# EAGLE design Stash_cap_board_hardctrl rev_H (EAGLE 9.6.2)
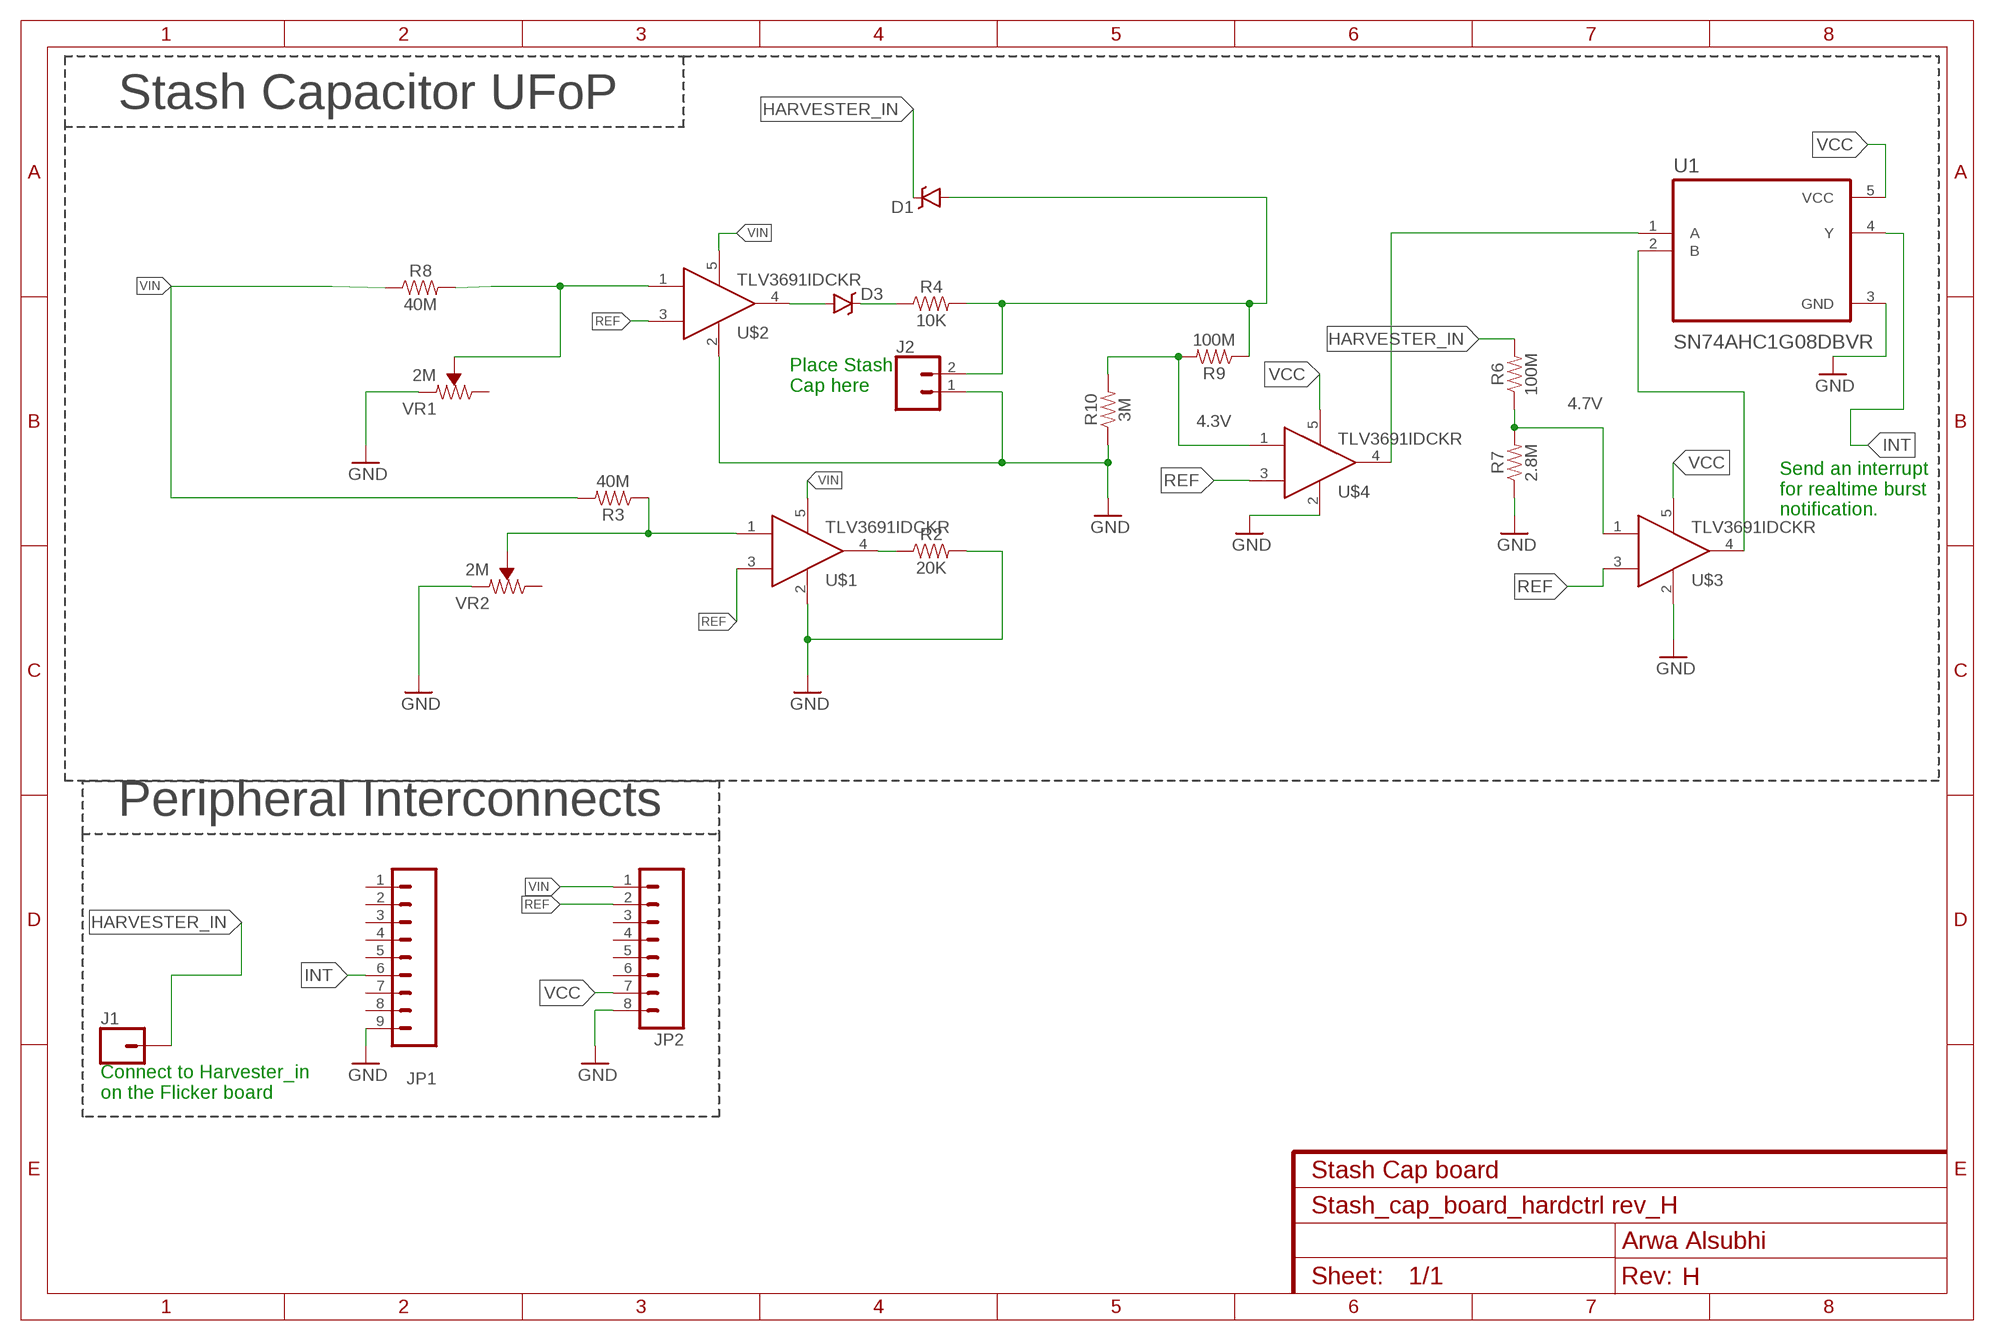
[diagram p0: schematic, sheet 1]
FRAME2 (FRAME-A4L): CNAME: Stash Cap board; CREVISION: H; DESIGNER: Arwa Alsubhi

## Parts
D1  RB751  DIODE-SCHOTTKY-RB751  [SOD-523]
D3  RB751  DIODE-SCHOTTKY-RB751  [SOD-523]
J1  CONN_01  [1X01]
J2  CONN_02  [1X02]
JP1  M091.27MM  [1X09-1.27MM]
JP2  M081.27MM  [1X08-1.27MM]
R2  20K  0.3OHM-0805-1/8W-1%  [0805]
R3  40M  0.3OHM-0805-1/8W-1%  [0805]
R4  10K  0603-RESISTOR-0603-1/10W-1%  [0603]
R6  100M  0.3OHM-0805-1/8W-1%  [0805]
R7  2.8M  0.3OHM-0805-1/8W-1%  [0805]
R8  40M  0.3OHM-0805-1/8W-1%  [0805]
R9  100M  0.3OHM-0805-1/8W-1%  [0805]
R10  3M  0.3OHM-0805-1/8W-1%  [0805]
U1  SN74AHC1G08DBVR  [SOT95P280X145-5N]
U$1  TLV3691IDCKR  [SOT353]
U$2  TLV3691IDCKR  [SOT353]
U$3  TLV3691IDCKR  [SOT353]
U$4  TLV3691IDCKR  [SOT353]
VR1  2M  TRIMPOT-SMD-3MM-CLOSED-1/8W-20%  [TRIMPOT-SMD-3MM-CLOSED]
VR2  2M  TRIMPOT-SMD-3MM-CLOSED-1/8W-20%  [TRIMPOT-SMD-3MM-CLOSED]

## Nets
CAP_VCC: D1.A J2.2 R4.2 R9.1
GND: J2.1 JP1.9 JP2.8 R2.2 R7.1 R10.1 U1.3(GND) U$1.2 U$2.2 U$3.2 U$4.2 VR1.1(CCW) VR2.1(CCW)
HARVESTER_IN: D1.C J1.1 R6.2
INT: JP1.6 U1.4(Y)
N$1: D3.A U$2.4
N$2: R2.1 U$1.4
N$4: R8.2 U$2.1 VR1.2(WIPER)
N$5: R3.1 U$1.1 VR2.2(WIPER)
N$6: R6.1 R7.2 U$3.1
N$7: D3.C R4.1
N$8: R9.2 R10.2 U$4.1
N$9: U1.2(B) U$3.4
N$10: U1.1(A) U$4.4
REF: JP2.2 U$1.3 U$2.3 U$3.3 U$4.3
VCC: JP2.7 U1.5(VCC) U$3.5 U$4.5
VIN: JP2.1 R3.2 R8.1 U$1.5 U$2.5
Unconnected: JP1.1 JP1.2 JP1.3 JP1.4 JP1.5 JP1.7 JP1.8 JP2.3 JP2.4 JP2.5 JP2.6 VR1.3(CW) VR2.3(CW)

## Notes on the sheet
- Stash Capacitor UFoP
- Place Stash 
  Cap here
- 4.7V
- 4.3V
- Send an interrupt 
  for realtime burst 
  notification.
- Peripheral Interconnects
- Connect to Harvester_in 
  on the Flicker board

## Library data of the parts
D1 D3 = SparkFun-DiscreteSemi:DIODE-SCHOTTKY: Schottky diodes in SFE's production catalog BAT20J 1A 23V 0.62Vf RB751 120mA 40V 0.37Vf PMEG4005EJ 0.5A 40V 0.42Vf MBRA140 1A 40V 0.5Vf B340A 3A 40V SMA; DIGIKEY: BAS40-02V-V-G-08GICT-ND; MPN: BAS40-02V-V-G-08; PROD_ID: DIO-11018
J1 = SparkFun-Connectors:CONN_01: Single connection point. Often used as Generic Header-pin footprint for 0.1 inch spaced/style header connections On any of the 0.1 inch spaced packages, you can populate with these: Break Away Headers - Straight <https://www.sparkfun.com/products/116> (PRT-00116) Break Away Male Headers - Right Angle <https://www.sparkfun.com/products/553> (PRT-00553) Female Headers <https://www.sparkfun.com/products/115> (PRT-00115) Break Away Headers - Machine Pin <https://www.sparkfun.com/products/117> (PRT-00117) Break Away Female Headers - Swiss Machine Pin <https://www.sparkfun.com/products/743> (PRT-00743) This device is also useful as a general connection point to wire up your design to another part of your project. Our various solder wires solder well into these plated through hole pads. Hook-Up Wire - Assortment (Stranded, 22 AWG) <https://www.sparkfun.com/products/11375> (PRT-11375) Hook-Up Wire - Assortment (Solid Core, 22 AWG) <https://www.sparkfun.com/products/11367> (PRT-11367) View the entire wire category on our website here <https://www.sparkfun.com/categories/141> Special notes: SMTSO-256-ET is a "flush mount" nut for a 4-40 screw. We mostly use this on specialty testbeds; it is a nice way to connect hardware to your PCB at an adjustable hieght. Also note, the SNAP packages are for using a snappable style connector. We sell a baggie of snaps and they are also used on two LilyPad designs: Snap Assortment - 30 pack (male and female) <https://www.sparkfun.com/products/11347> (DEV-11347) LilyPad Arduino SimpleSnap <https://www.sparkfun.com/products/10941> (DEV-10941) LilyPad SimpleSnap Protoboard <https://www.sparkfun.com/products/10940> (DEV-10940)
J2 = SparkFun-Connectors:CONN_02: Multi connection point. Often used as Generic Header-pin footprint for 0.1 inch spaced/style header connections On any of the 0.1 inch spaced packages, you can populate with these: Break Away Headers - Straight <https://www.sparkfun.com/products/116> (PRT-00116) Break Away Male Headers - Right Angle <https://www.sparkfun.com/products/553> (PRT-00553) Female Headers <https://www.sparkfun.com/products/115> (PRT-00115) Break Away Headers - Machine Pin <https://www.sparkfun.com/products/117> (PRT-00117) Break Away Female Headers - Swiss Machine Pin <https://www.sparkfun.com/products/743> (PRT-00743) For SCREWTERMINALS and SPRING TERMINALS visit here: Screw Terimnals on SparkFun.com <https://www.sparkfun.com/search/results?term=Screw+Terminals> (5mm/3.5mm/2.54mm spacing) This device is also useful as a general connection point to wire up your design to another part of your project. Our various solder wires solder well into these plated through hole pads. Hook-Up Wire - Assortment (Stranded, 22 AWG) <https://www.sparkfun.com/products/11375> (PRT-11375) Hook-Up Wire - Assortment (Solid Core, 22 AWG) <https://www.sparkfun.com/products/11367> (PRT-11367) View the entire wire category on our website here <https://www.sparkfun.com/categories/141> Special notes: Molex polarized connector foot print use with: PRT-08233 with associated crimp pins and housings. 2.54_SCREWTERM for use with PRT-10571. 3.5mm Screw Terminal footprints for PRT-08084 5mm Screw Terminal footprints for use with PRT-08432
JP1 = SparkFun-Connectors:M09: Header 9 Standard 9-pin 0.1" header. Use with straight break away headers (SKU : PRT-00116), right angle break away headers (PRT-00553), swiss pins (PRT-00743), machine pins (PRT-00117), and female headers (PRT-00115).; DIGIKEY: S9014E-09-ND; MANUFACTURERPARTNUMBER: GRPB091VWVN-RC; MPN: GRPB091VWVN-RC
JP2 = SparkFun-Connectors:M08: Header 8 Standard 8-pin 0.1" header. Use with straight break away headers (SKU : PRT-00116), right angle break away headers (PRT-00553), swiss pins (PRT-00743), machine pins (PRT-00117), and female headers (PRT-00115).; DIGIKEY: S9014E-08-ND; MANUFACTURERPARTNUMBER: GRPB081VWVN-RC; MPN: GRPB081VWVN-RC
R2 R3 R6-R10 = SparkFun-Resistors:0.3OHM: 0.3Ω resistor A resistor is a passive two-terminal electrical component that implements electrical resistance as a circuit element. Resistors act to reduce current flow, and, at the same time, act to lower voltage levels within circuits. - Wikipedia; PROD_ID: RES-11622; VALUE: 0.3
R4 = Arwa_lib:0603-RESISTOR: resistor A resistor is a passive two-terminal electrical component that implements electrical resistance as a circuit element. Resistors act to reduce current flow, and, at the same time, act to lower voltage levels within circuits. - Wikipedia; PROD_ID: RES-08787
U1 = SN74AHC1G08DBVR:SN74AHC1G08DBVR: Check availability <https://pricing.snapeda.com/parts/SN74AHC1G08DBVR/Texas%20Instruments/view-part?ref=eda>; AVAILABILITY: In Stock; DESCRIPTION: Single 2-input, 2-V to 5.5-V AND gate; MF: Texas Instruments; MP: SN74AHC1G08DBVR; PACKAGE: SOT-23-5 Texas Instruments; PRICE: None; PURCHASE-URL: https://pricing.snapeda.com/search/part/SN74AHC1G08DBVR/?ref=eda
U$1-U$4 = Arwa_lib:TLV3691IDCKR
VR1 VR2 = SparkFun-Resistors:TRIMPOT: Trimming Potentiometer (Trimpot) Three-terminal potentiometers, with an adjustable wiper and two adjustable resistors. A pot can be used to create a configurable voltage divider, or as a variable resistor. "Trimpots" are a subset of potentiometers, usually intended for "set-and-forget" applications. They're often more delicate than standard potentiometers - rated for fewer turns. Variants PTH-KNOB - PTH Trimpot w/ finger-adjustable knob Trimpot 10K with Knob <https://www.sparkfun.com/products/9806> (COM-09806) Datasheet <http://www.sparkfun.com/datasheets/Components/General/TSR-3386.pdf> SMD-3MM-CLOSED-FRAME - SMD 3mm Square Closed-Frame Trimpot Used on e.g. EasyDriver - Stepper Motor Driver <https://www.sparkfun.com/products/12779> Datasheet <http://www.bitechnologies.com/pdfs/22.pdf> (22AR10KTR) SMD-5MM - SMD 5mm Square Closed-Frame Trimpot Used on e.g. IOIO-OTG - V2.2 <https://www.sparkfun.com/products/13613> Datasheet <http://www.vishay.com/docs/51008/ts53.pdf> (TS53YL502MR10) SMD-3MM-1/10W-25% - 3mm Square Open-Frame Trimpot Used on e.g. SparkFun Shapeoko <https://www.sparkfun.com/products/13899> Datasheet <http://www.bourns.com/docs/Product-Datasheets/TC33.pdf> (TC33X-2-103E); PROD_ID: RES-09285; VALUE: 10k

## Board
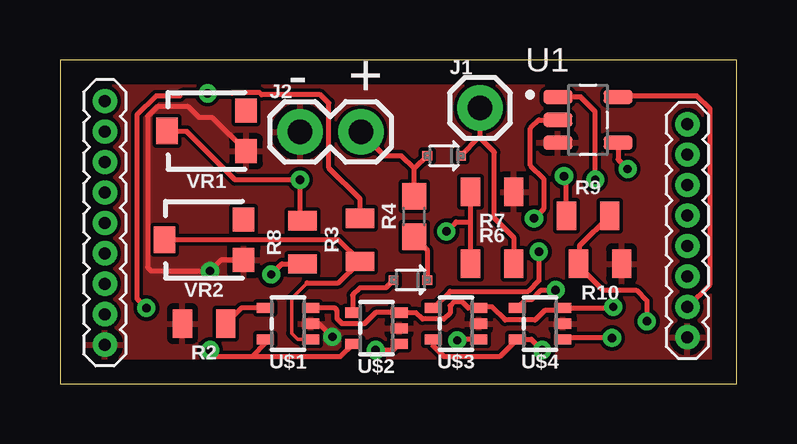
[diagram p1: board, top side]
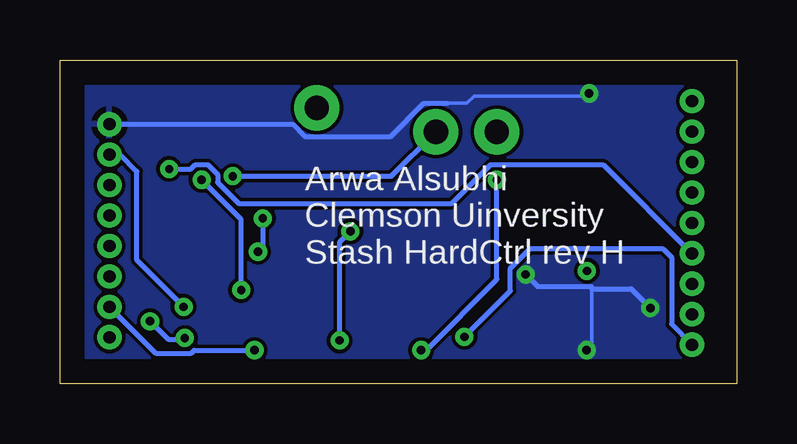
[diagram p2: board, bottom side, seen from below]

Size 28.2 x 13.5 mm. Coordinates in mm from the lower left corner, seen from the top.
Outline: 0,0 28.2,0 28.2,13.5 0,13.5 0,0
Copper layers (1*16): Top 0.035mm / dielectric 1.5mm / Bottom 0.035mm
Design rules "default": minimum track width 6mil, minimum drill 0.35mm, track to track 6mil, track to pad 6mil, pad to pad 6mil, via to via 6mil, smd to smd 6mil, copper to edge 40mil, drill to drill 6mil, minimum pad ring 10mil, minimum via ring 8mil, stop-mask expansion 4mil, vias tented up to drill 0mil, thermal gap 10mil

### Footprints (pad centres in the part's own frame; a part is rotated, then mirrored left to right if it is on the bottom)
SOD-523 = smd 0.4 x 0.4: A -0.7,0; C 0.7,0
1X01 = drill 1.016 pad 1.88: 1 0,0
1X02 = drill 1.016 pad 1.88: 1 0,0; 2 2.54,0
1X09-1.27MM = drill 0.508 pad 1: 1 0,0; 2 1.27,0; 3 2.54,0; 4 3.81,0; 5 5.08,0; 6 6.35,0; 7 7.62,0; 8 8.89,0; 9 10.16,0
1X08-1.27MM = drill 0.508 pad 1: 1 0,0; 2 1.27,0; 3 2.54,0; 4 3.81,0; 5 5.08,0; 6 6.35,0; 7 7.62,0; 8 8.89,0
0805 = smd 0.8 x 1.2: 1 -0.9,0; 2 0.9,0
0603 = smd 1.1 x 1: 1 -0.85,0; 2 0.85,0
SOT95P280X145-5N = smd 1.21 x 0.59: 1 -1.255,0.95; 2 -1.255,0; 3 -1.255,-0.95; 4 1.255,-0.95; 5 1.255,0.95
SOT353 = smd 0.42 x 0.7: 1 -0.65,-0.95; 2 0,-0.95; 3 0.65,-0.95; 4 0.65,0.95; 5 -0.65,0.95
TRIMPOT-SMD-3MM-CLOSED = smd 1 x 0.9: 1 -0.85,-1.65; 3 0.85,-1.65 | smd 1.1 x 0.9: 2 0,1.65

### Placement (x,y rotation side)
D1  16,9.5 0 top
D3  14.6,4.32 0 top
J1  17.5,11.5 0 top
J2  10,10.5 0 top
JP1  1.87,11.78 270 top
JP2  26.14,10.82 270 top
R2  6,2.5 180 top
R3  12.5,6 90 top
R4  14.76,6.97 90 top
R6  18,5 0 top
R7  18,8 180 top
R8  10.1,5.89 90 top
R9  22,7 0 top
R10  22.5,5 180 top
U1  22,11 0 top
U$1  9.5,2.5 90 top
U$2  13.18,2.31 90 top
U$3  16.5,2.5 90 top
U$4  20,2.5 90 top
VR1  6.1,10.54 90 top
VR2  6,6 90 top

### Tracks (layer width: path | path; a pad name or v marks a point on that pad's centre or on a via)
CAP_VCC  (via drill 0.35)
  Top 0.152: 14.75,7.88 15,8.12 R4.2 14.75,7.88
  Top 0.2: R4.2 14.76,8.96 | J2.2 13.54,9.5 14.22,9.5 14.76,8.96 | R9.1 21.1,8.55 v21,8.65 | D1.A 14.76,8.96
  Bottom 0.2: v21,8.65 14.39,8.65 J2.2
GND  (via drill 0.35)
  Top 0.2: U$1.2 10.8,2.5 v11.35,1.95 | VR2.1 6.7,5.15 v6.25,4.7 3.8,4.7 3.65,4.85 3.65,11.15 4.05,11.55 5.35,11.55 5.8,11.1 6.34,11.1 VR1.1
  Bottom 0.2: v11.35,1.95 9.43,3.87 9.43,4.81 8.61,5.63 3.09,5.63 2.72,5.26 2.72,2.47 JP1.9
  pour Top: 0,14 29,14 29,-1 0,-1
HARVESTER_IN
  Top 0.2: D1.C 17.48,10.28 | 17.48,10.28 17.5,10.3 J1.1 | 17.48,10.28 18.1,9.65 18.1,6.9 18.9,6.1 R6.2
INT  (via drill 0.35)
  Top 0.2: U1.4 23.25,9.35 v23.65,8.95
  Bottom 0.2: v23.65,8.95 22.74,8.95 22.56,9.13 22.04,9.13 21.63,8.72 21.63,8.39 20.76,7.52 11.87,7.52 10.26,9.13 5.57,9.13 JP1.6
N$1
  Top 0.2: U$2.4 12.19,3 12.19,3.69 12.5,4 13.58,4 D3.A
N$2
  Top 0.2: R2.1 7.55,3.15 U$1.4
N$4  (via drill 0.35)
  Top 0.152: 4.57,10.52 VR1.2
  Top 0.2: U$2.1 13.86,1.39 v13.15,1.39 | R8.2 10,6.89 v10,8.5 7.3,8.5 5.28,10.52 4.57,10.52
  Bottom 0.2: v10,8.5 10,4.34 12.95,1.39 v13.15,1.39
N$5
  Top 0.152: 10.3,4.2 9.65,3.55 9.65,2.1 9.9,1.85 U$1.1
  Top 0.2: 10.3,4.2 11.6,4.2 R3.1 11.6,6 VR2.2
N$6  (via drill 0.35)
  Top 0.2: 17.1,6.75 17.1,5.06 17.07,5.03 R6.1 | U$3.1 16.6,1.85 v16.55,1.8 | v16.1,6.35 16.5,6.75 17.1,6.75 | R7.2 17.1,6.75
  Bottom 0.2: v16.55,1.8 16.55,5.9 v16.1,6.35
N$7
  Top 0.2: R4.1 15.3,5.58 D3.C
N$8  (via drill 0.35)
  Top 0.152: 21.64,4.88 R10.2 21.64,5.03
  Top 0.2: R9.2 21.64,5.74 21.64,5.03 | 21.64,4.88 22.62,3.9 24,3.9 24.45,3.45 v24.45,2.6 | v23,1.9 21,1.9 U$4.1
  Bottom 0.2: v24.45,2.6 23.7,1.85 23.05,1.85 v23,1.9
N$9  (via drill 0.35)
  Top 0.2: U$3.4 16.25,3.85 19.5,3.85 19.95,4.3 v19.95,5.5 | U1.2 19.95,11 19.6,10.65 19.6,9.1 20.15,8.55 20.15,7.29 v19.75,6.89
  Bottom 0.2: v19.75,6.89 19.75,5.7 v19.95,5.5
N$10  (via drill 0.35)
  Top 0.2: v20.65,3.9 20.05,3.9 19.65,3.5 19.4,3.5 U$4.4 | v22.3,8.5 22.3,11.35 21.7,11.95 U1.1
  Bottom 0.2: v20.65,3.9 20.65,6.85 v22.3,8.5
REF  (via drill 0.35)
  Top 0.152: U$2.3 | 17.53,3.2 U$3.3
  Top 0.2: U$2.3 13.15,2.96 12.69,2.5 11.75,2.5 11.55,2.7 11.55,3.05 11.45,3.15 U$1.3 | v23.05,3.2 23,3.15 U$4.3 20.85,3.05 20.2,3.05 19.8,2.65 18.55,2.65 18,3.2 17.53,3.2 | U$2.3 14.83,2.96 15.1,2.69 16,2.69 16.25,2.93 16.25,3.25 16.4,3.4 16.75,3.4 17,3.15 U$3.3
  Bottom 0.2: v23.05,3.2 25,5.15 25,8.85 25.7,9.55 JP2.2
VCC  (via drill 0.35)
  Top 0.2: U$3.5 15.55,1.57 16,1.12 18.32,1.12 U$4.5 19.64,1.85 v20.09,1.39 | JP2.7 27.08,4.14 27.08,11.45 26.53,12 23.3,12 U1.5
  Bottom 0.2: v20.09,1.39 22.61,1.39 22.74,1.27 24.21,1.27 JP2.7
VIN  (via drill 0.35)
  Top 0.152: 8.6,1.9 U$1.5 | 6.38,1.12 6.25,1.25 v6.25,1.39 | v6.15,12.11 5.11,12.11 5,12
  Top 0.2: 8,1.12 8.6,1.72 8.6,1.9 | 8,1.12 6.38,1.12 | U$2.5 11.69,1.12 8,1.12 | 5,12 4,12 3.2,11.2 3.2,3.55 v3.6,3.15 | R3.2 12.5,7.7 11.2,9 11.2,11.7 10.85,12.05 8.4,12.05 8.3,12.14 7.2,12.14 7.16,12.11 v6.15,12.11 | v8.8,4.55 9.24,4.99 R8.1
  Bottom 0.152: v6.25,1.39 6.05,1.6 6.05,3.95 6.05,4.05 | 12.05,11.69 11.26,11.69 10.95,12 6.26,12 v6.15,12.11
  Bottom 0.2: JP2.1 18.51,10.82 17.99,10.31 14.42,10.31 13.03,11.69 12.05,11.69 | v3.6,3.15 4.4,3.95 6.05,3.95 | v8.8,4.55 8.3,4.05 6.05,4.05
  pour Bottom: 0,14.5 29.3,14.5 29.3,-1 0,-1

### Text on the board
tPlace: - | +
bNames: Arwa Alsubhi / Clemson Uinversity / Stash HardCtrl rev H